# EAGLE design rumblecation+ble (EAGLE 6.6.0)

## Sheet 1 of 4
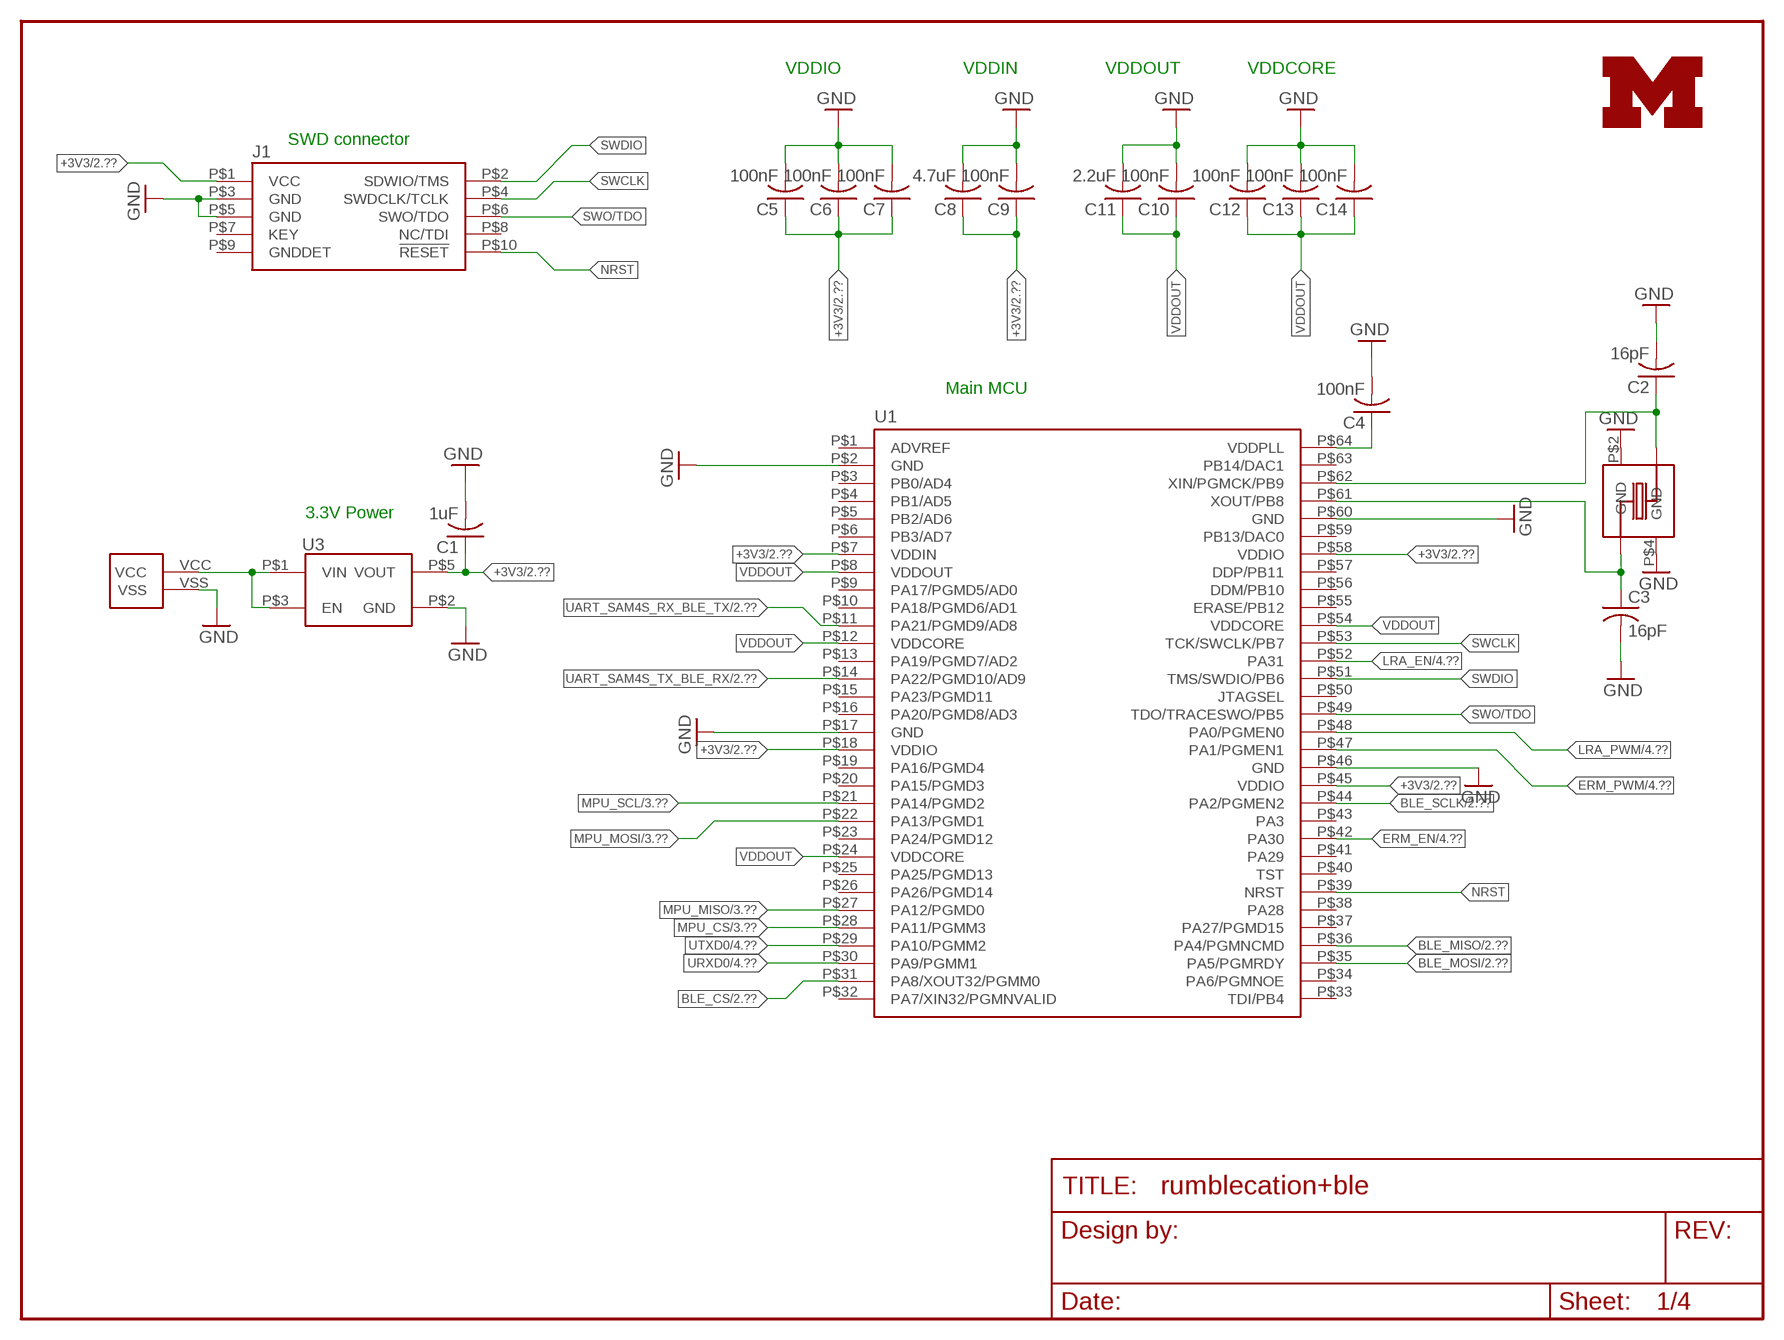
[diagram p0: schematic, sheet 1]

### Parts
C1  1uF  C-USC0402  [C0402]
C2  16pF  C-USC0402  [C0402]
C3  16pF  C-USC0402  [C0402]
C4  100nF  C-USC0402  [C0402]
C5  100nF  C-USC0402  [C0402]
C6  100nF  C-USC0402  [C0402]
C7  100nF  C-USC0402  [C0402]
C8  4.7uF  C-USC0603  [C0603]
C9  100nF  C-USC0402  [C0402]
C10  100nF  C-USC0402  [C0402]
C11  2.2uF  C-USC0603  [C0603]
C12  100nF  C-USC0402  [C0402]
C13  100nF  C-USC0402  [C0402]
C14  100nF  C-USC0402  [C0402]
J1  FCI_CORTEX_SWD_CONNECTOR  [FCI_10_PIN_SMD_0.5]
J2  JST_S2B-PH-SM4-TB_CONNECTOR  [JST_S2B-PH-SM4-TB_CONNECTOR]
LOGO1  UMICH_SOLID_TINY  [UMICH_SOLID_50MIL]
U1  ATSAMD4S2BA-AU  [ATMEL_10X10_QFP_64]
U3  TLV73333PDBVT  [TI_SOT-23-5]
Y1  ECS_ECS-120-20-33-CKM-TR  [ECS_ECX-32]

### Nets
+3V3: C1.1 C5.1 C6.1 C7.1 C8.1 C9.1 J1.P$1(VCC) U1.P$7(VDDIN) U1.P$18(VDDIO) U1.P$45(VDDIO) U1.P$58(VDDIO) U3.P$5(VOUT) ; also sheet 2,3,4
BLE_CS: U1.P$31(PA8/XOUT32/PGMM0) ; also sheet 2
BLE_MISO: U1.P$36(PA4/PGMNCMD) ; also sheet 2
BLE_MOSI: U1.P$35(PA5/PGMRDY) ; also sheet 2
BLE_SCLK: U1.P$44(PA2/PGMEN2) ; also sheet 2
ERM_EN: U1.P$42(PA30) ; also sheet 4
ERM_PWM: U1.P$47(PA1/PGMEN1) ; also sheet 4
GND: C1.2 C2.2 C3.2 C4.2 C5.2 C6.2 C7.2 C8.2 C9.2 C10.2 C11.2 C12.2 C13.2 C14.2 J1.P$3(GND) J1.P$5(GND) J2.VSS U1.P$2(GND) U1.P$17(GND) U1.P$46(GND) U1.P$60(GND) U3.P$2(GND) Y1.P$2(GND) Y1.P$4(GND) ; also sheet 2,3,4
LRA_EN: U1.P$52(PA31) ; also sheet 4
LRA_PWM: U1.P$48(PA0/PGMEN0) ; also sheet 4
MPU_CS: U1.P$28(PA11/PGMM3) ; also sheet 3
MPU_MISO: U1.P$27(PA12/PGMD0) ; also sheet 3
MPU_MOSI: U1.P$22(PA13/PGMD1) ; also sheet 3
MPU_SCL: U1.P$21(PA14/PGMD2) ; also sheet 3
N$6: C4.1 U1.P$64(VDDPLL)
N$7: J2.VCC U3.P$1(VIN) U3.P$3(EN)
NRST: J1.P$10(!RESET!) U1.P$39(NRST)
SWCLK: J1.P$4(SWDCLK/TCLK) U1.P$53(TCK/SWCLK/PB7)
SWDIO: J1.P$2(SDWIO/TMS) U1.P$51(TMS/SWDIO/PB6)
SWO/TDO: J1.P$6(SWO/TDO) U1.P$49(TDO/TRACESWO/PB5)
UART_SAM4S_RX_BLE_TX: U1.P$11(PA21/PGMD9/AD8) ; also sheet 2
UART_SAM4S_TX_BLE_RX: U1.P$14(PA22/PGMD10/AD9) ; also sheet 2
URXD0: U1.P$30(PA9/PGMM1) ; also sheet 4
UTXD0: U1.P$29(PA10/PGMM2) ; also sheet 4
VDDOUT: C10.1 C11.1 C12.1 C13.1 C14.1 U1.P$8(VDDOUT) U1.P$12(VDDCORE) U1.P$24(VDDCORE) U1.P$54(VDDCORE)
XIN: C2.1 U1.P$62(XIN/PGMCK/PB9) Y1.P$1
XOUT: C3.1 U1.P$61(XOUT/PB8) Y1.P$3
Unconnected: J1.P$7(KEY) J1.P$8(NC/TDI) J1.P$9(GNDDET) U1.P$1(ADVREF) U1.P$3(PB0/AD4) U1.P$4(PB1/AD5) U1.P$5(PB2/AD6) U1.P$6(PB3/AD7) U1.P$9(PA17/PGMD5/AD0) U1.P$10(PA18/PGMD6/AD1) U1.P$13(PA19/PGMD7/AD2) U1.P$15(PA23/PGMD11) U1.P$16(PA20/PGMD8/AD3) U1.P$19(PA16/PGMD4) U1.P$20(PA15/PGMD3) U1.P$23(PA24/PGMD12) U1.P$25(PA25/PGMD13) U1.P$26(PA26/PGMD14) U1.P$32(PA7/XIN32/PGMNVALID) U1.P$33(TDI/PB4) U1.P$34(PA6/PGMNOE) U1.P$37(PA27/PGMD15) U1.P$38(PA28) U1.P$40(TST) U1.P$41(PA29) U1.P$43(PA3) U1.P$50(JTAGSEL) U1.P$55(ERASE/PB12) U1.P$56(DDM/PB10) U1.P$57(DDP/PB11) U1.P$59(PB13/DAC0) U1.P$63(PB14/DAC1)

### Notes on the sheet
- VDDIO | VDDIN | VDDOUT | VDDCORE
- SWD connector
- Main MCU
- 3.3V Power

## Sheet 2 of 4
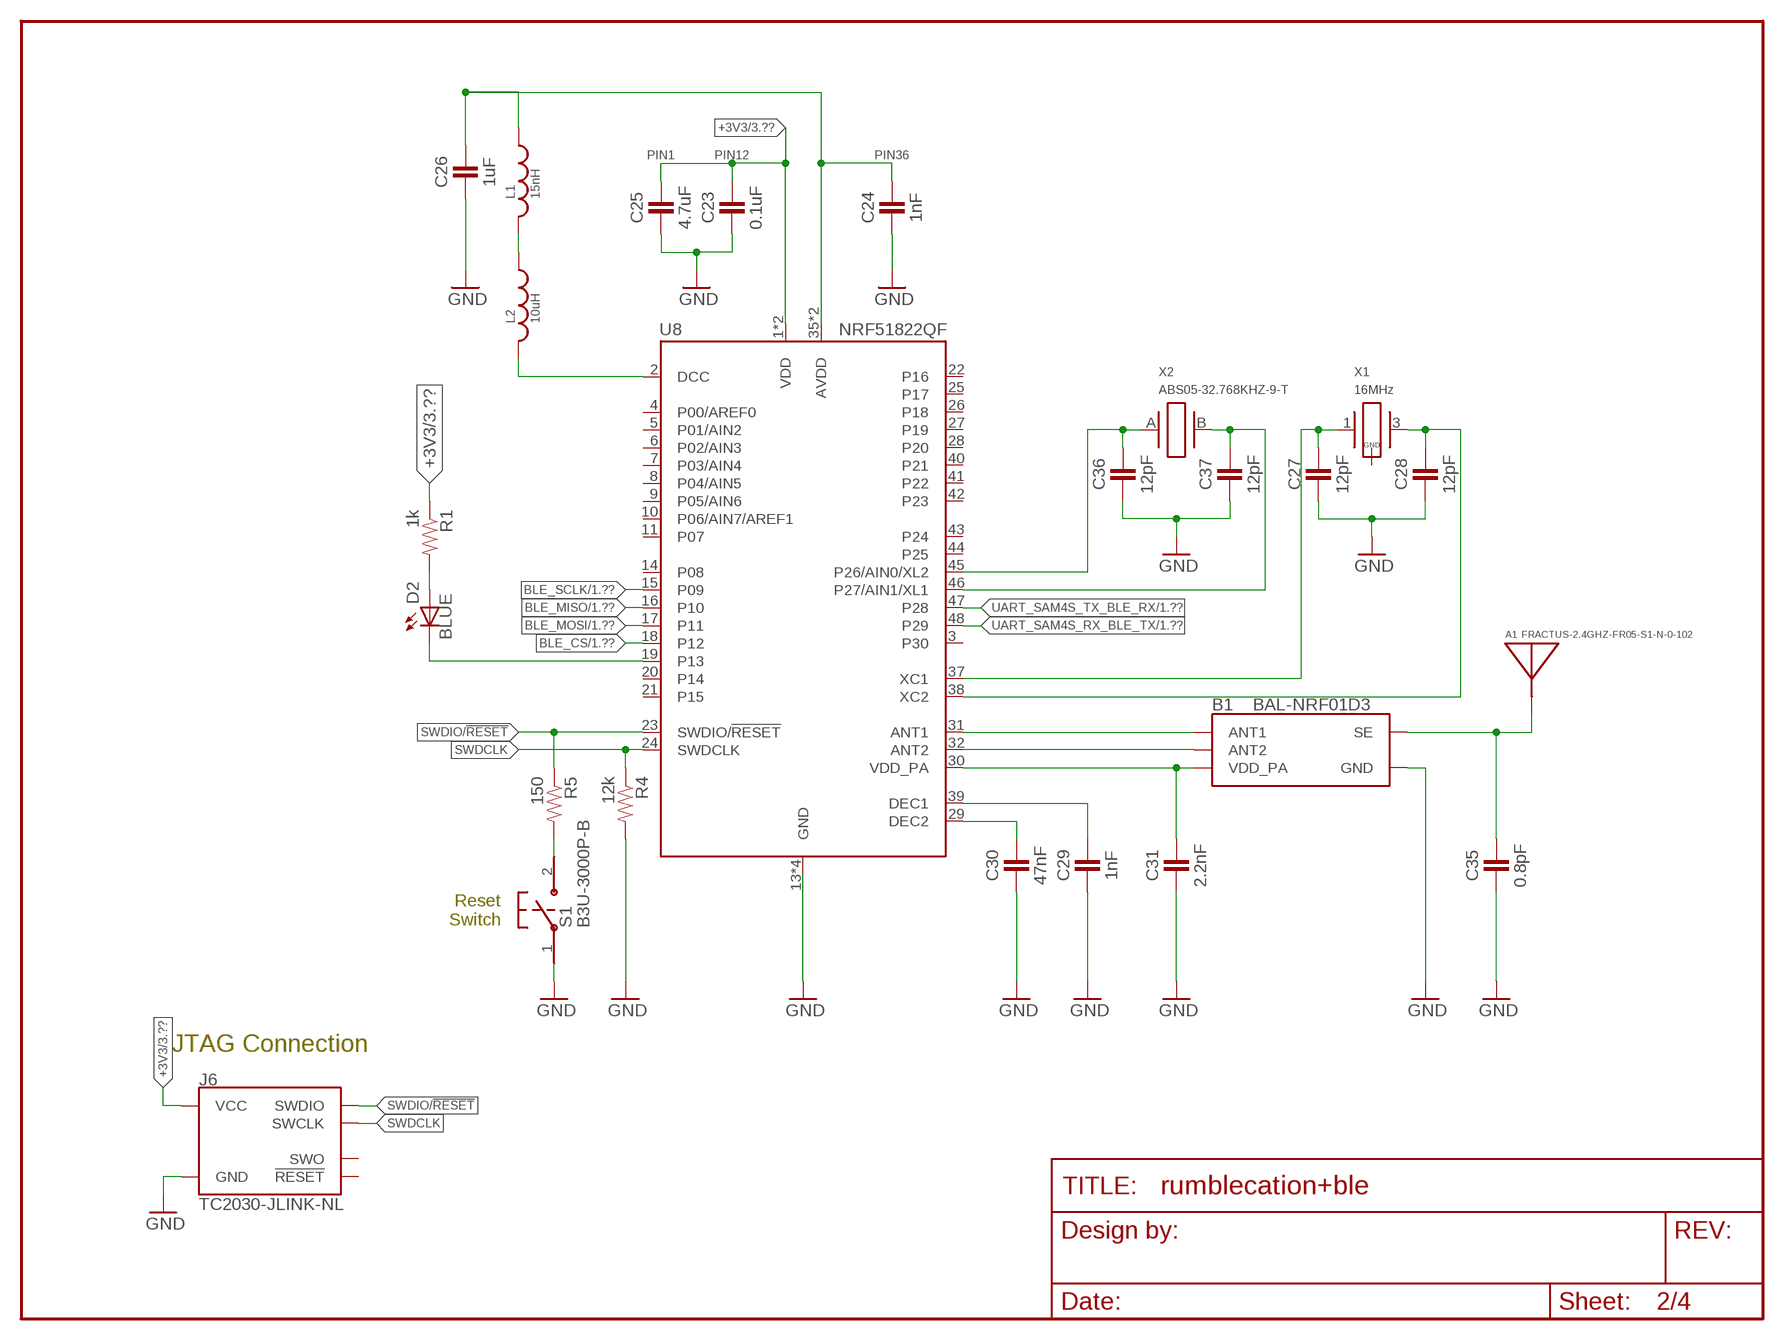
[diagram p1: schematic, sheet 2]

### Parts
A1  FRACTUS-2.4GHZ-FR05-S1-N-0-102  [FRACTUS-ANTENNA-FR05-S1-N-0-102]
B1  BAL-NRF01D3  [BAL-NRF01D3]
C23  0.1uF  CAPACITOR  [0402_CAP]
C24  1nF  CAPACITOR  [0402_CAP]
C25  4.7uF  CAPACITOR  [0402_CAP]
C26  1uF  CAPACITOR  [0402_CAP]
C27  12pF  CAPACITOR  [0402_CAP]
C28  12pF  CAPACITOR  [0402_CAP]
C29  1nF  CAPACITOR  [0402_CAP]
C30  47nF  CAPACITOR  [0402_CAP]
C31  2.2nF  CAPACITOR  [0402_CAP]
C35  0.8pF  CAPACITOR  [0402_CAP]
C36  12pF  CAPACITOR  [0402_CAP]
C37  12pF  CAPACITOR  [0402_CAP]
D2  BLUE  LED0603  [LED-0603]
J6  TC2030-JLINK-NL  [TC2030-IDC-NL]
L1  15nH  INDUCTOR0402  [0402_CAP]
L2  10uH  INDUCTOR0603  [0603_CAP]
R1  1k  RESISTOR  [0402_RES]
R4  12k  RESISTOR  [0402_RES]
R5  150  RESISTOR  [0402_RES]
S1  B3U-3000P-B  [B3U-3000P-B]
U8  NRF51822QF  [QFN-48-6MM]
X1  16MHz  TXC-8Y  [TXC-8Y]
X2  ABS05-32.768KHZ-9-T  [ABS05]

### Nets
+3V3: C23.1 C25.1 J6.1(VCC) R1.1 U8.1(VDD) U8.12(VDD) ; also sheet 1,3,4
A0: C36.1 U8.45(P26/AIN0/XL2) X2.A
A1: C37.1 U8.46(P27/AIN1/XL1) X2.B
AVDD: C24.1 C26.1 L1.1 U8.35(AVDD) U8.36(AVDD)
BLE_CS: U8.18(P12) ; also sheet 1
BLE_MISO: U8.16(P10) ; also sheet 1
BLE_MOSI: U8.17(P11) ; also sheet 1
BLE_SCLK: U8.15(P09) ; also sheet 1
DCC: L2.2 U8.2(DCC)
GND: B1.GND C23.2 C24.2 C25.2 C26.2 C27.2 C28.2 C29.2 C30.2 C31.2 C35.2 C36.2 C37.2 J6.5(GND) R4.2 S1.1 U8.13(GND) U8.33(GND) U8.34(GND) U8.GND ; also sheet 1,3,4
N$11: B1.ANT1 U8.31(ANT1)
N$12: B1.ANT2 U8.32(ANT2)
N$13: A1.1(ANTENNA) B1.SE C35.1
N$14: L1.2 L2.1
N$15: D2.C U8.19(P13)
N$16: C27.1 U8.37(XC1) X1.1
N$17: C28.1 U8.38(XC2) X1.3
N$18: C29.1 U8.39(DEC1)
N$19: C30.1 U8.29(DEC2)
N$20: R5.2 S1.2
N$23: D2.A R1.2
SWDCLK: J6.4(SWCLK) R4.1 U8.24(SWDCLK)
SWDIO/!RESET: J6.2(SWDIO) R5.1 U8.23(SWDIO/!RESET)
UART_SAM4S_RX_BLE_TX: U8.48(P29) ; also sheet 1
UART_SAM4S_TX_BLE_RX: U8.47(P28) ; also sheet 1
VDD_PA: B1.VCC(VDD_PA) C31.1 U8.30(VDD_PA)
Unconnected: J6.3(!RESET) J6.6(SWO) U8.3(P30) U8.4(P00/AREF0) U8.5(P01/AIN2) U8.6(P02/AIN3) U8.7(P03/AIN4) U8.8(P04/AIN5) U8.9(P05/AIN6) U8.10(P06/AIN7/AREF1) U8.11(P07) U8.14(P08) U8.20(P14) U8.21(P15) U8.22(P16) U8.25(P17) U8.26(P18) U8.27(P19) U8.28(P20) U8.40(P21) U8.41(P22) U8.42(P23) U8.43(P24) U8.44(P25) X1.2(GND) X1.4(GND)

### Notes on the sheet
- PIN1 | PIN12 | PIN36
- Reset
  Switch
- JTAG Connection

## Sheet 3 of 4
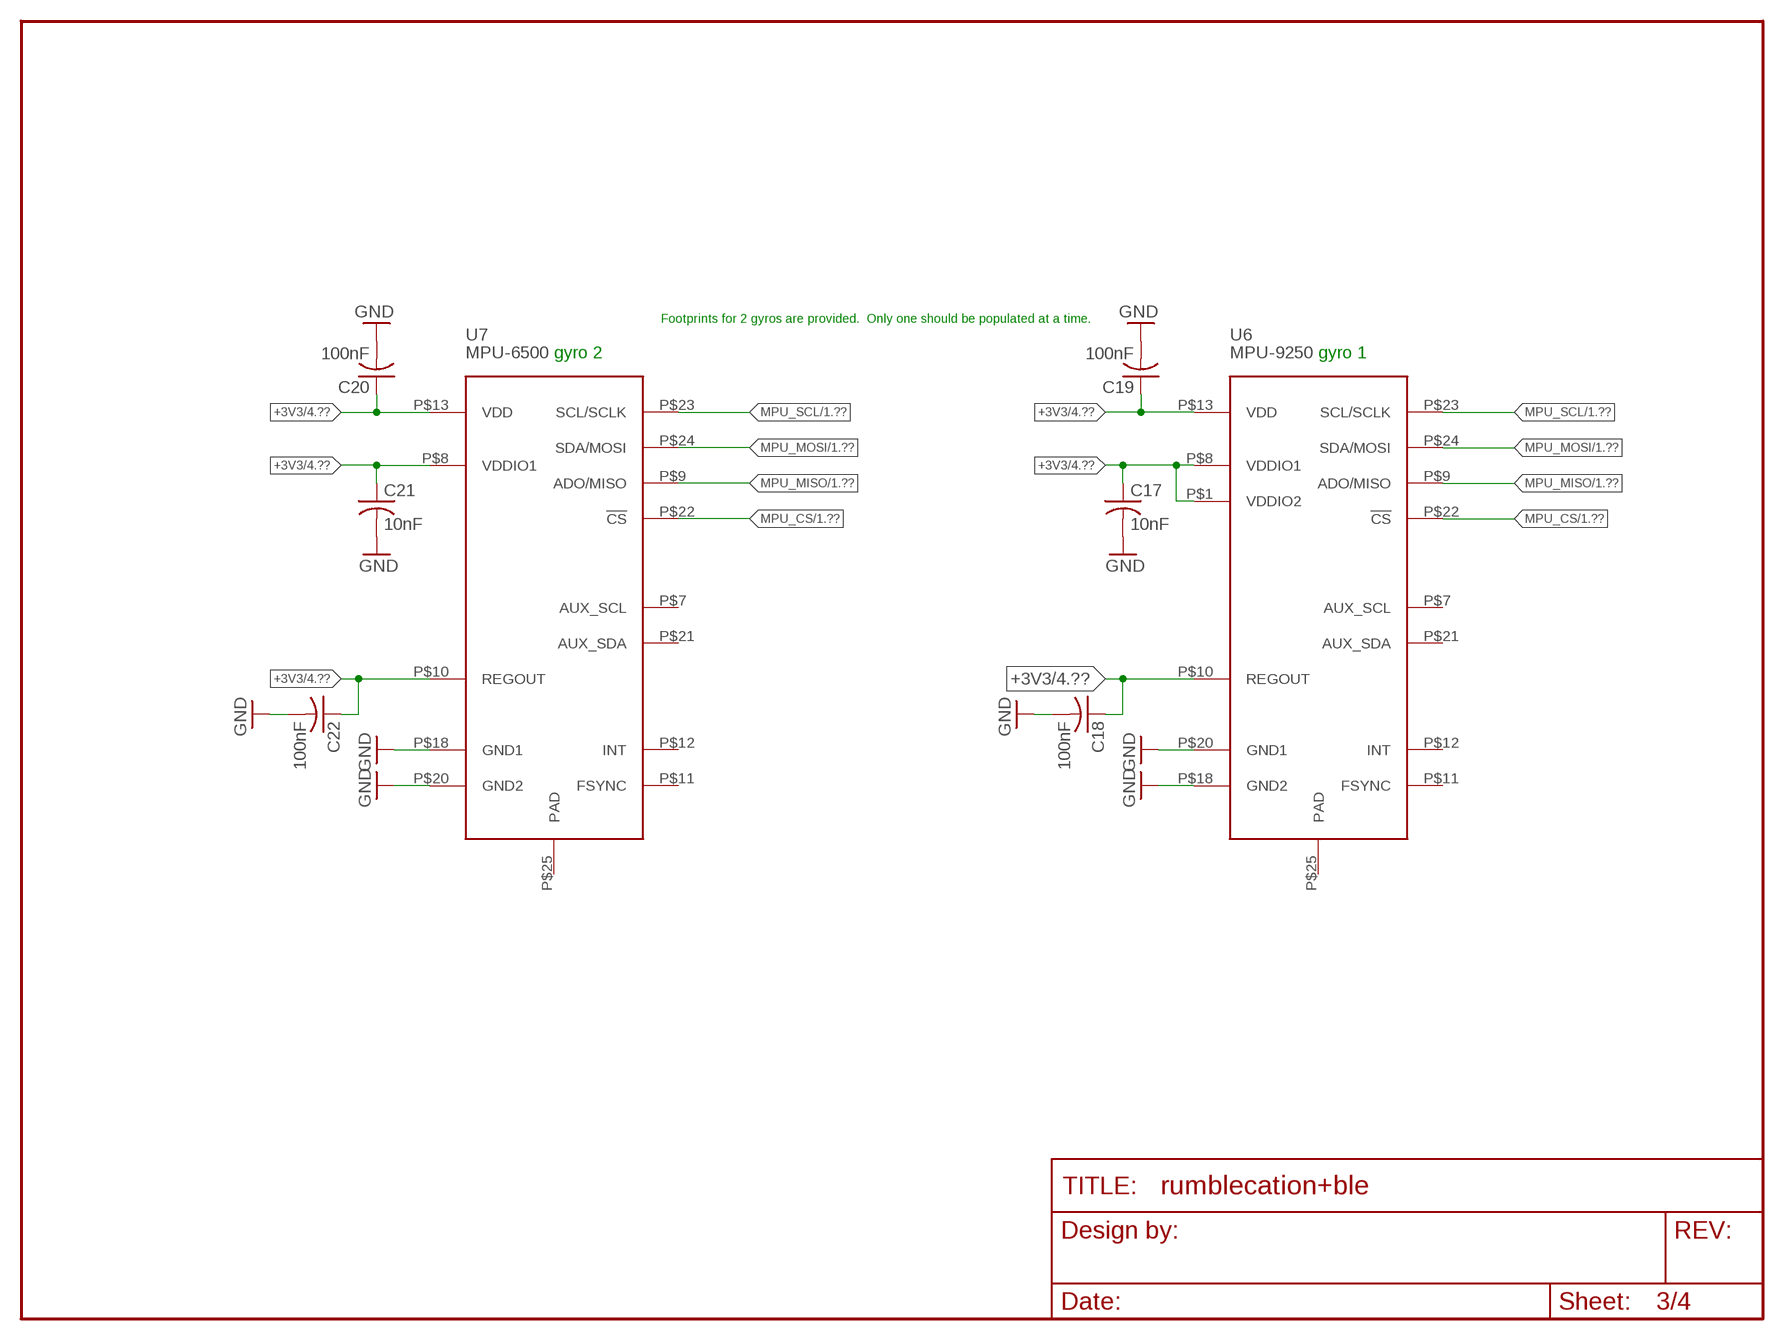
[diagram p2: schematic, sheet 3]

### Parts
C17  10nF  C-USC0402  [C0402]
C18  100nF  C-USC0402  [C0402]
C19  100nF  C-USC0402  [C0402]
C20  100nF  C-USC0402  [C0402]
C21  10nF  C-USC0402  [C0402]
C22  100nF  C-USC0402  [C0402]
U6  MPU-9250  [MPU-9X50]
U7  MPU-6500  [MPU-9X50]

### Nets
+3V3: C17.1 C19.1 C20.1 C21.1 C22.1 U6.P$1(VDDIO2) U6.P$8(VDDIO1) U6.P$13(VDD) U7.P$8(VDDIO1) U7.P$10(REGOUT) U7.P$13(VDD) ; also sheet 1,2,4
GND: C17.2 C18.2 C19.2 C20.2 C21.2 C22.2 U6.P$18(GND2) U6.P$20(GND1) U7.P$18(GND1) U7.P$20(GND2) ; also sheet 1,2,4
MPU_CS: U6.P$22(!CS) U7.P$22(!CS) ; also sheet 1
MPU_MISO: U6.P$9(ADO/MISO) U7.P$9(ADO/MISO) ; also sheet 1
MPU_MOSI: U6.P$24(SDA/MOSI) U7.P$24(SDA/MOSI) ; also sheet 1
MPU_SCL: U6.P$23(SCL/SCLK) U7.P$23(SCL/SCLK) ; also sheet 1
N$9: C18.1 U6.P$10(REGOUT)
Unconnected: U6.P$7(AUX_SCL) U6.P$11(FSYNC) U6.P$12(INT) U6.P$21(AUX_SDA) U6.P$25(PAD) U7.P$7(AUX_SCL) U7.P$11(FSYNC) U7.P$12(INT) U7.P$21(AUX_SDA) U7.P$25(PAD)

### Notes on the sheet
- Footprints for 2 gyros are provided.  Only one should be populated at a time.
- gyro 2 | gyro 1

## Sheet 4 of 4
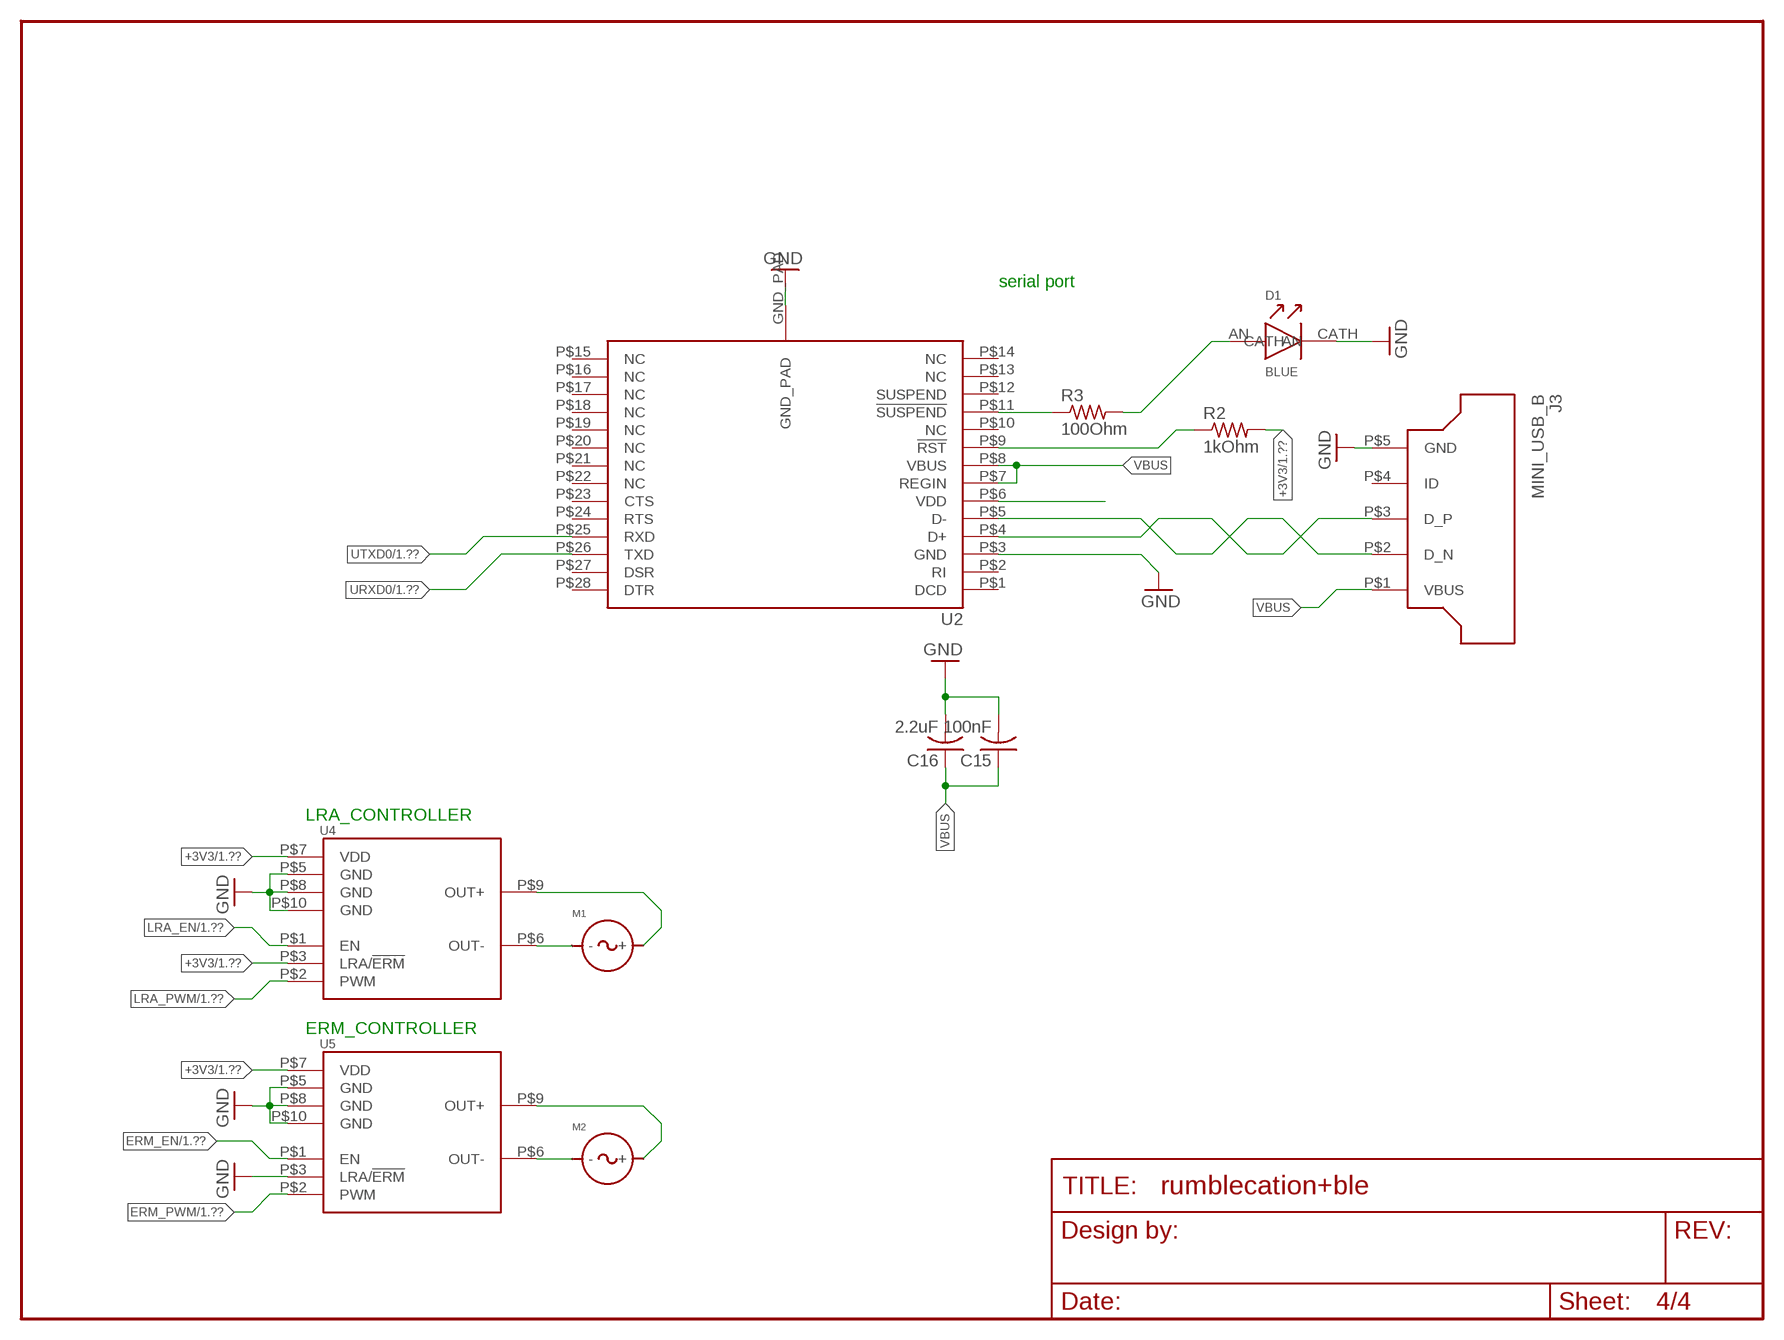
[diagram p3: schematic, sheet 4]

### Parts
C15  100nF  C-USC0402  [C0402]
C16  2.2uF  C-USC0402  [C0402]
D1  BLUE  LED0603  [D0603]
J3  MINI_USB_B  [UX60SC-MB-5ST]
M1  PRECISION_MICRODRIVES_C100-10  [PRECISION_MICRODRIVES_10MM]
M2  PRECISION_MICRODRIVES_310-113  [PRECISION_MICRODRIVES_10MM]
R2  1kOhm  R-US_R0402  [R0402]
R3  100Ohm  R-US_R0402  [R0402]
U2  SILABS_CP2102  [SILABS_QFN28]
U4  TI_DRV2603  [TI_S-PWQFN-N10]
U5  TI_DRV2603  [TI_S-PWQFN-N10]

### Nets
+3V3: R2.2 U2.P$6(VDD) U4.P$3(LRA/!ERM!) U4.P$7(VDD) U5.P$7(VDD) ; also sheet 1,2,3
D+: J3.P$3(D_P) U2.P$4(D+)
D-: J3.P$2(D_N) U2.P$5(D-)
ERM_EN: U5.P$1(EN) ; also sheet 1
ERM_PWM: U5.P$2(PWM) ; also sheet 1
GND: C15.2 C16.2 D1.CATH J3.P$5(GND) U2.GND_PAD U2.P$3(GND) U4.P$5(GND) U4.P$8(GND) U4.P$10(GND) U5.P$3(LRA/!ERM!) U5.P$5(GND) U5.P$8(GND) U5.P$10(GND) ; also sheet 1,2,3
LRA_EN: U4.P$1(EN) ; also sheet 1
LRA_PWM: U4.P$2(PWM) ; also sheet 1
N$1: R2.1 U2.P$9(!RST!)
N$2: M1.P$1(-) U4.P$6(OUT-)
N$3: M1.P$2(+) U4.P$9(OUT+)
N$4: R3.1 U2.P$11(!SUSPEND!)
N$5: D1.AN R3.2
N$8: M2.P$2(+) U5.P$9(OUT+)
N$10: M2.P$1(-) U5.P$6(OUT-)
URXD0: U2.P$26(TXD) ; also sheet 1
UTXD0: U2.P$25(RXD) ; also sheet 1
VBUS: C15.1 C16.1 J3.P$1(VBUS) U2.P$7(REGIN) U2.P$8(VBUS)
Unconnected: J3.P$4(ID) U2.P$1(DCD) U2.P$2(RI) U2.P$10(NC) U2.P$12(SUSPEND) U2.P$13(NC) U2.P$14(NC) U2.P$15(NC) U2.P$16(NC) U2.P$17(NC) U2.P$18(NC) U2.P$19(NC) U2.P$20(NC) U2.P$21(NC) U2.P$22(NC) U2.P$23(CTS) U2.P$24(RTS) U2.P$27(DSR) U2.P$28(DTR)

### Notes on the sheet
- serial port
- LRA_CONTROLLER
- ERM_CONTROLLER

## Library data of the parts
A1 = chips:FRACTUS-2.4GHZ-FR05-S1-N-0-102: Fractus Compact Reach XtendTM chip antenna is engineered specifically for Bluetooth, WLAN 802.11 b/g/n and other wireless devices operating at the ISM 2.4 GHz band. Compact Reach Xtend combines small form factor size and high performance to improve the functionality of your wireless devices.; RICHARDSON_RFPD: FR05-S1-N-0102B
B1 = chips:BAL-NRF01D3: 50 ohm nominal input / conjugate match balun to nRF51422-QFAA, nRF24LE1, nRF51822-QFAA/AB, with integrated harmonic filter; DIGIKEY: 497-13637-1-ND; MOUSER: 511-BAL-NRF01D3
C1-C7 C9 C10 C12-C22 = rumbleaction_parts_lib:C-US: CAPACITOR, American symbol
C8 C11 = adafruit:C-US: CAPACITOR, American symbol
C23 = passives:CAPACITOR: 0402 Capacitor; DIGIKEY: 445-4952-1-ND
C24 C29 = passives:CAPACITOR: 0402 Capacitor; DIGIKEY: 490-1303-1-ND
C25 = passives:CAPACITOR: 0402 Capacitor; DIGIKEY: 445-5947-1-ND
C26 = passives:CAPACITOR: 0402 Capacitor; DIGIKEY: 1276-1513-1-ND
C27 C28 C36 C37 = passives:CAPACITOR: 0402 Capacitor; DIGIKEY: 490-6197-1-ND
C30 = passives:CAPACITOR: 0402 Capacitor; DIGIKEY: 445-1264-1-ND
C31 = passives:CAPACITOR: 0402 Capacitor; DIGIKEY: 490-5419-1-ND
C35 = passives:CAPACITOR: 0402 Capacitor; DIGIKEY: 490-6269-1-ND
D1 = john_mamish_assorted_analog_library:LED0603
D2 = SparkFun-LED:LED: LEDs Standard schematic elements and footprints for 5mm, 3mm, 1206, and 0603 sized LEDs. 5mm - Spark Fun Electronics SKU : COM-00529 (and others)
J1 = rumbleaction_parts_lib:FCI_CORTEX_SWD_CONNECTOR
J2 = rumbleaction_parts_lib:JST_S2B-PH-SM4-TB_CONNECTOR
J3 = john_mamish_connector_library:MINI_USB_B: Mini USB-B Surface Mount; DIGIKEY_PN: H11671CT-ND
J6 = connector:TC2030-JLINK
L1 = passives:INDUCTOR; DIGIKEY: 587-1521-1-ND
L2 = passives:INDUCTOR; DIGIKEY: 490-4025-1-ND
LOGO1 = logos:UMICH_SOLID
M1 = rumbleaction_parts_lib:PRECISION_MICRODRIVES_C100-10
M2 = rumbleaction_parts_lib:PRECISION_MICRODRIVES_310-113
R1 = passives:RESISTOR: Resistor Basic schematic elements and footprints for 0603, 1206, and PTH resistors.; DIGIKEY: RHM1.0KCECT-ND
R2 R3 = adafruit:R-US_: RESISTOR, American symbol
R4 = passives:RESISTOR: Resistor Basic schematic elements and footprints for 0603, 1206, and PTH resistors.; DIGIKEY: RHM12.0KCDCT-ND
R5 = passives:RESISTOR: Resistor Basic schematic elements and footprints for 0603, 1206, and PTH resistors.; DIGIKEY: RHM150CDCT-ND
S1 = switches:B3U; DIGIKEY: SW1256CT-ND
U1 = rumbleaction_parts_lib:ATSAMD4S2BA-AU
U2 = rumbleaction_parts_lib:SILABS_CP2102
U3 = rumbleaction_parts_lib:TLV73333PDBVT
U4 U5 = rumbleaction_parts_lib:TI_DRV2603
U6 = rumbleaction_parts_lib:MPU-9250: 9-Axis Gyro+Accel+Magnetometer
U7 = rumbleaction_parts_lib:MPU-6500
U8 = chips:NRF51822: Multiprotocol Bluetooth® 4.0 low energy/2.4 GHz RF SoC; DIGIKEY: 1490-1032-1-ND; MOUSER: 949-NRF51822-QFAB-R7
X1 = crystals:TXC-8Y: 2mmx1.6mm SMD Crystal; DIGIKEY: 887-2003-1-ND
X2 = crystals:ABS05-32.768KHZ: 32.768kHz Crystal; DIGIKEY: 535-11897-1-ND
Y1 = rumbleaction_parts_lib:ECS_ECS-120-20-33-CKM-TR

## Board
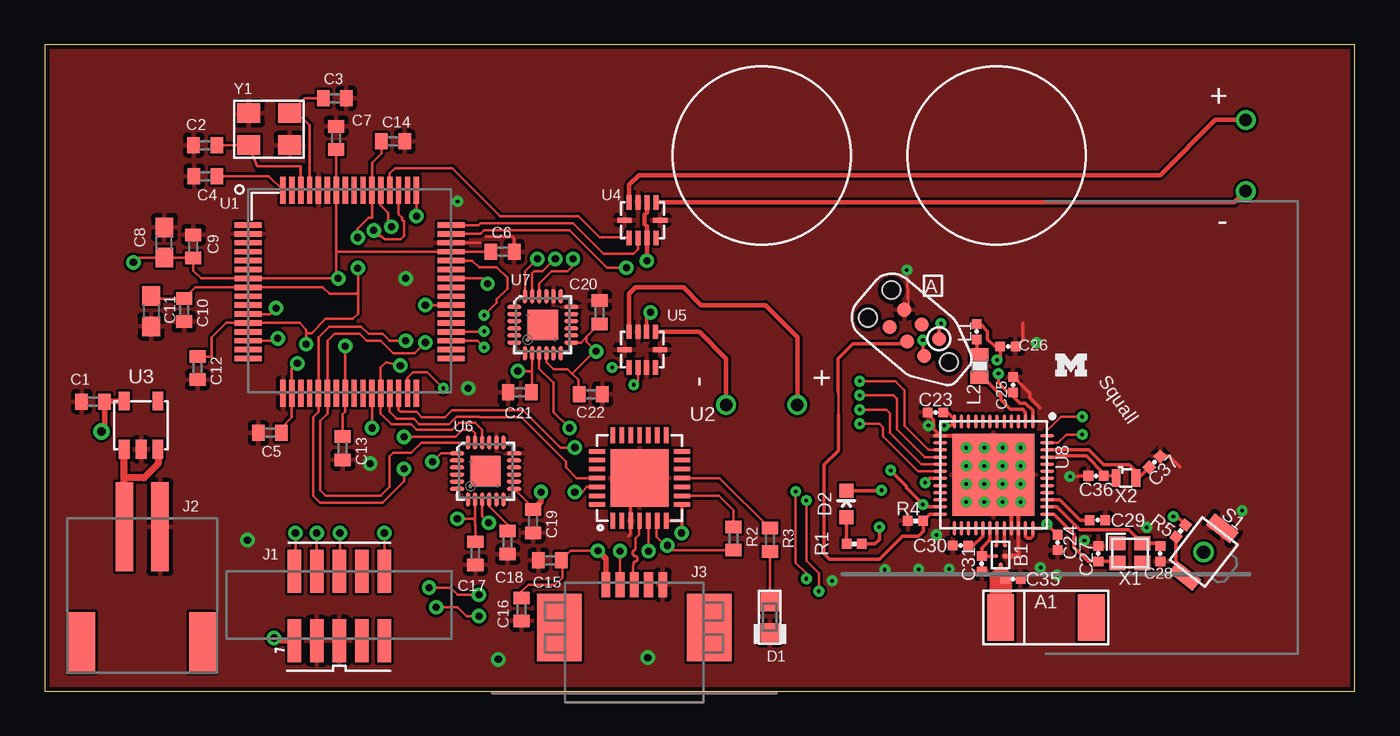
[diagram p4: board, top side]
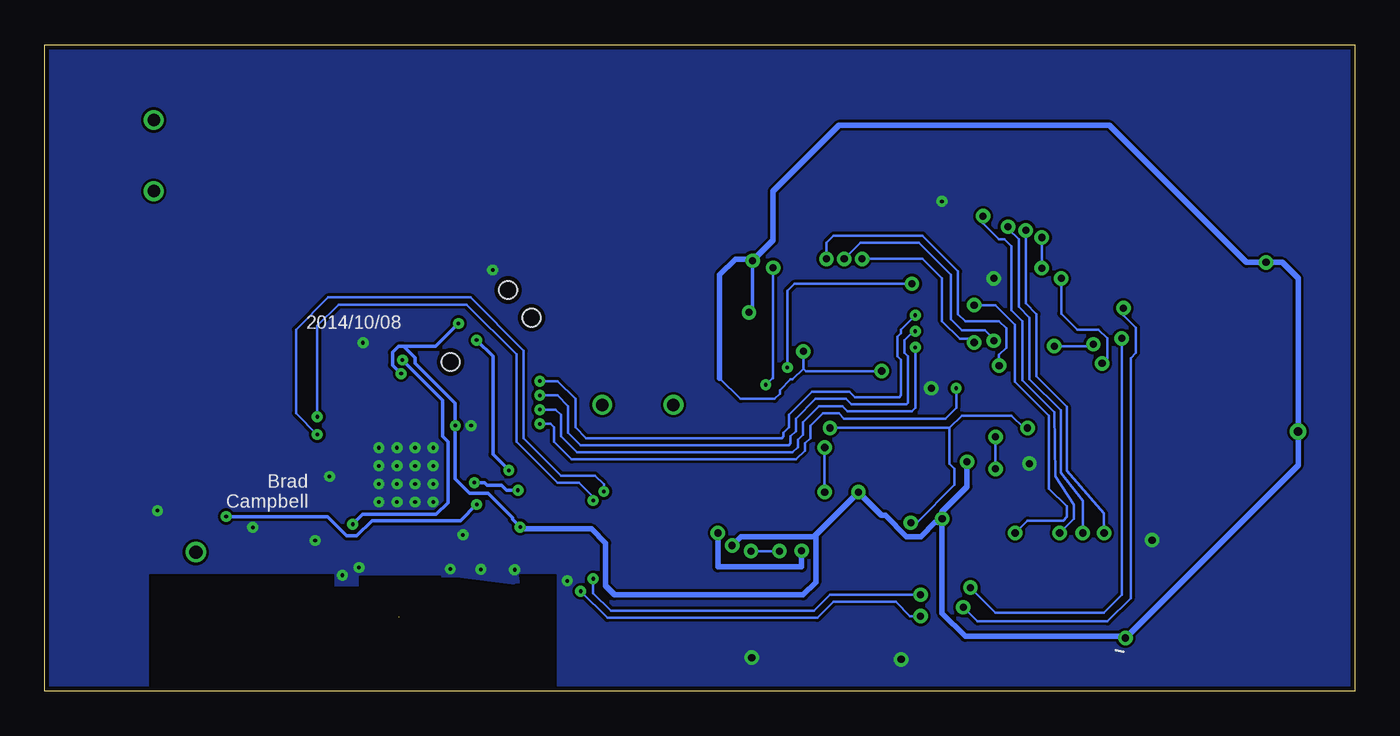
[diagram p5: board, bottom side, seen from below]

Size 73.64 x 36.34 mm. Coordinates in mm from the lower left corner, seen from the top.
Outline: 0,0 73.64,0 73.64,36.34 0,36.34 0,0
Copper layers (1*16): Top 0.0178mm / dielectric 59mil / Bottom 0.0178mm
Design rules "sunstone-2lyr_v1.0.0.3": minimum track width 6mil, minimum drill 14mil, track to track 6mil, track to pad 6mil, pad to pad 6mil, via to via 6mil, smd to smd 6mil, copper to edge 10mil, drill to drill 16mil, minimum pad ring 8mil, minimum via ring 8mil, stop-mask expansion 3mil, vias tented up to drill 50mil, thermal gap 10mil

### Footprints (pad centres in the part's own frame; a part is rotated, then mirrored left to right if it is on the bottom)
FRACTUS-ANTENNA-FR05-S1-N-0-102 = smd 1.5 x 2.6: 1 -2.55,0; 2 2.55,0
BAL-NRF01D3 = smd 0.22 x 0.22: ANT1 -0.537,-0.25; ANT2 -0.537,0.25; GND 0.069,0.25; SE 0.537,0; VCC 0.069,-0.25
C0402 = smd 0.7 x 0.9: 1 -0.65,0; 2 0.65,0
C0603 = smd 1.1 x 1: 1 -0.85,0; 2 0.85,0
0402_CAP = smd 0.536 x 0.546: 1 -0.433,0; 2 0.433,0
D0603 = smd 1 x 1.09: AN 0,-0.89; CATH 0,0.89
LED-0603 = smd 0.8 x 0.8: A 0,-0.75; C 0,0.75
FCI_10_PIN_SMD_0.5 = smd 0.76 x 2.4: P$1 0,-3.9; P$2 0,0; P$3 1.27,-3.9; P$4 1.27,0; P$5 2.54,-3.9; P$6 2.54,0; P$7 3.81,-3.9; P$8 3.81,0; P$9 5.08,-3.9; P$10 5.08,0
JST_S2B-PH-SM4-TB_CONNECTOR = smd 1.5 x 3.4: P$1 0,0; P$3 6.8,0 | smd 1 x 5: VCC 4.4,-6.5; VSS 2.4,-6.5
UX60SC-MB-5ST = smd 2.5 x 3.8: M$1 -4.2,3.7; M$2 4.2,3.7 | smd 0.5 x 1.4: P$1 -1.6,6.1; P$2 -0.8,6.1; P$3 0,6.1; P$4 0.8,6.1; P$5 1.6,6.1
TC2030-IDC-NL = smd 0.787 x 0.787: 1 -1.27,-0.635; 2 -1.27,0.635; 3 0,-0.635; 4 0,0.635; 5 1.27,-0.635; 6 1.27,0.635 | hole 1.016: -2.54,0; 2.54,1.016; 2.54,-1.016
0603_CAP = smd 0.7 x 1: 1 -0.65,0; 2 0.65,0
PRECISION_MICRODRIVES_10MM = drill 0.7: P$1 -14,2; P$2 -14,-2
0402_RES = smd 0.536 x 0.546: 1 -0.433,0; 2 0.433,0
R0402 = smd 0.7 x 0.9: 1 -0.65,0; 2 0.65,0
B3U-3000P-B = smd 0.8 x 1.7: 1 -1.7,0; 2 1.7,0 | drill 0.75: P$1 0,0
ATMEL_10X10_QFP_64 = smd 1.5 x 0.3: P$1 0,0; P$2 0,-0.5; P$3 0,-1; P$4 0,-1.5; P$5 0,-2; P$6 0,-2.5; P$7 0,-3; P$8 0,-3.5; P$9 0,-4; P$10 0,-4.5; P$11 0,-5; P$12 0,-5.5; P$13 0,-6; P$14 0,-6.5; P$15 0,-7; P$16 0,-7.5; P$33 11.4,-7.5; P$34 11.4,-7; P$35 11.4,-6.5; P$36 11.4,-6; P$37 11.4,-5.5; P$38 11.4,-5; P$39 11.4,-4.5; P$40 11.4,-4; P$41 11.4,-3.5; P$42 11.4,-3; P$43 11.4,-2.5; P$44 11.4,-2; P$45 11.4,-1.5; P$46 11.4,-1; P$47 11.4,-0.5; P$48 11.4,0 | smd 0.3 x 1.5: P$17 1.95,-9.45; P$18 2.45,-9.45; P$19 2.95,-9.45; P$20 3.45,-9.45; P$21 3.95,-9.45; P$22 4.45,-9.45; P$23 4.95,-9.45; P$24 5.45,-9.45; P$25 5.95,-9.45; P$26 6.45,-9.45; P$27 6.95,-9.45; P$28 7.45,-9.45; P$29 7.95,-9.45; P$30 8.45,-9.45; P$31 8.95,-9.45; P$32 9.45,-9.45; P$49 9.45,1.95; P$50 8.95,1.95; P$51 8.45,1.95; P$52 7.95,1.95; P$53 7.45,1.95; P$54 6.95,1.95; P$55 6.45,1.95; P$56 5.95,1.95; P$57 5.45,1.95; P$58 4.95,1.95; P$59 4.45,1.95; P$60 3.95,1.95; P$61 3.45,1.95; P$62 2.95,1.95; P$63 2.45,1.95; P$64 1.95,1.95
SILABS_QFN28 = smd 3.25 x 3.25: GND_PAD 2.4,-1.5 | smd 0.9 x 0.25: P$1 0,0; P$2 0,-0.5; P$3 0,-1; P$4 0,-1.5; P$5 0,-2; P$6 0,-2.5; P$7 0,-3; P$15 4.8,-3; P$16 4.8,-2.5; P$17 4.8,-2; P$18 4.8,-1.5; P$19 4.8,-1; P$20 4.8,-0.5; P$21 4.8,0 | smd 0.25 x 0.9: P$8 0.9,-3.9; P$9 1.4,-3.9; P$10 1.9,-3.9; P$11 2.4,-3.9; P$12 2.9,-3.9; P$13 3.4,-3.9; P$14 3.9,-3.9; P$22 3.9,0.9; P$23 3.4,0.9; P$24 2.9,0.9; P$25 2.4,0.9; P$26 1.9,0.9; P$27 1.4,0.9; P$28 0.9,0.9
TI_SOT-23-5 = smd 0.6 x 1.05: P$1 0,-2.7; P$2 0.95,-2.7; P$3 1.9,-2.7; P$4 1.9,0; P$5 0,0
TI_S-PWQFN-N10 = smd 0.28 x 0.8: P$1 0.65,-1; P$2 1.15,-1; P$3 1.65,-1; P$4 2.15,-1; P$6 2.15,1; P$7 1.65,1; P$8 1.15,1; P$9 0.65,1 | smd 0.8 x 0.28: P$5 2.4,0; P$10 0.4,0
MPU-9X50 = smd 0.8 x 0.22: P$1 -1.6,1; P$2 -1.6,0.6; P$3 -1.6,0.2; P$4 -1.6,-0.2; P$5 -1.6,-0.6; P$6 -1.6,-1; P$13 1.6,-1; P$14 1.6,-0.6; P$15 1.6,-0.2; P$16 1.6,0.2; P$17 1.6,0.6; P$18 1.6,1 | smd 0.22 x 0.8: P$7 -1,-1.6; P$8 -0.6,-1.6; P$9 -0.2,-1.6; P$10 0.2,-1.6; P$11 0.6,-1.6; P$12 1,-1.6; P$19 1,1.6; P$20 0.6,1.6; P$21 0.2,1.6; P$22 -0.2,1.6; P$23 -0.6,1.6; P$24 -1,1.6 | smd 1.7 x 1.7: P$25 0,0
QFN-48-6MM = smd 0.8 x 0.203: 1 -3,2.2; 2 -3,1.8; 3 -3,1.4; 4 -3,1; 5 -3,0.6; 6 -3,0.2; 7 -3,-0.2; 8 -3,-0.6; 9 -3,-1; 10 -3,-1.4; 11 -3,-1.8; 12 -3,-2.2; 25 3,-2.2; 26 3,-1.8; 27 3,-1.4; 28 3,-1; 29 3,-0.6; 30 3,-0.2; 31 3,0.2; 32 3,0.6; 33 3,1; 34 3,1.4; 35 3,1.8; 36 3,2.2 | smd 0.203 x 0.8: 13 -2.2,-3; 14 -1.8,-3; 15 -1.4,-3; 16 -1,-3; 17 -0.6,-3; 18 -0.2,-3; 19 0.2,-3; 20 0.6,-3; 21 1,-3; 22 1.4,-3; 23 1.8,-3; 24 2.2,-3; 37 2.2,3; 38 1.8,3; 39 1.4,3; 40 1,3; 41 0.6,3; 42 0.2,3; 43 -0.2,3; 44 -0.6,3; 45 -1,3; 46 -1.4,3; 47 -1.8,3; 48 -2.2,3 | smd 4.6 x 4.6: GND 0,0
TXC-8Y = smd 0.9 x 0.8: 1 -0.7,-0.55; 2 0.7,-0.55; 3 0.7,0.55; 4 -0.7,0.55
ABS05 = smd 0.5 x 1: A -0.55,0; B 0.55,0
ECS_ECX-32 = smd 1.3 x 1.1: P$1 0,-1.8; P$2 2.3,-1.8; P$3 2.3,0; P$4 0,0

### Placement (x,y rotation side)
A1  56.27,4.16 0 top
B1  53.73,7.67 270 top
C1  2.73,16.28 180 top
C2  9.03,30.69 180 top
C3  16.31,33.33 0 top
C4  9.05,28.94 180 top
C5  12.67,14.53 180 top
C6  25.74,24.7 0 top
C7  16.4,31.09 90 top
C8  6.74,25.22 90 top
C9  8.36,25 90 top
C10  7.84,21.42 270 top
C11  5.99,21.36 270 top
C12  8.6,18.16 270 top
C13  16.76,13.66 270 top
C14  19.59,30.9 0 top
C15  28.4,7.38 180 top
C16  26.82,4.61 270 top
C17  24.21,7.76 270 top
C18  26.03,8.36 270 top
C19  27.45,9.56 270 top
C20  31.2,21.3 90 top
C21  26.7,16.8 180 top
C22  30.7,16.7 0 top
C23  50.07,15.68 180 top
C24  56.92,8.37 270 top
C25  54.43,17.22 90 top
C26  54.14,19.38 0 top
C27  59.22,7.74 90 top
C28  62.7,7.74 270 top
C29  59.17,9.62 0 top
C30  51.47,8.2 180 top
C31  52.67,7.17 270 top
C35  54.42,6.32 0 top
C36  59.09,12.11 180 top
C37  62.39,12.9 45 top
D1  40.76,4.17 180 top
D2  45.06,10.53 0 top
J1  14.03,6.75 0 top
J2  8.89,2.74 180 top
J3  33.14,-0.1 0 top
J6  48.88,20.14 140 top
L1  52.38,20.21 270 top
L2  52.54,18.28 270 top
LOGO1  57.67,18.34 0 top
M1  53.5,30.1 180 top
M2  40.3,30.1 90 top
R1  45.5,8.29 180 top
R2  38.71,8.59 270 top
R3  40.76,8.52 270 top
R4  48.94,9.58 180 top
R5  63.84,9.02 232 top
S1  65.13,7.82 232 top
U1  11.45,26.2 0 top
U2  31.93,9.59 90 top
U3  4.48,16.31 0 top
U4  32.2,26.47 0 top
U5  32.19,19.2 0 top
U6  24.79,12.38 0 top
U7  28,20.6 0 top
U8  53.33,12.16 270 top
X1  60.99,7.77 0 top
X2  60.77,11.99 0 top
Y1  11.47,32.49 0 top

### Tracks (layer width: path | path; a pad name or v marks a point on that pad's centre or on a via)
+3V3  (via drill 0.2, 0.4, 0.5)
  Top 0.152: 24.2,9.6 24.2,9.3 24.21,9.29 C17.1 | 24.2,9.6 U6.P$8 | C19.1 27.45,10.32 U6.P$13 | C6.1 U1.P$45 16.4,24.7 | C7.1 U1.P$58 16.4,24.7 | v23.2,9.7 24.1,9.7 24.2,9.6 | U6.P$1 22.28,13.38 v21.8,12.9 | U2.P$6 34.4,9.55 34.4,8.7 34.9,8.2 v35,8.2 35.26,7.94 R2.2 | v5,24.1 5.27,24.37 C8.1 8.34,24.37 C9.1 8.36,23.64 8.8,23.2 U1.P$7 v16.51,23.2 16.4,23.31 16.4,24.7 | C5.1 13.32,14.82 13.9,15.4 U1.P$18 13.9,18.12 v14.21,18.43 | U7.P$13 30.15,19.6 30.46,19.91 | 30.46,19.91 C20.1 | U7.P$10 28.2,18.5 28.6,18.1 29.4,18.1 29.65,17.85 | 29.65,17.85 30,17.5 30,16.75 C22.1 | U7.P$8 27.4,18.03 | 27.4,18.03 27.4,16.85 C21.1 | 30.46,19.91 30.46,19.64 30.9,19.2 | 30.9,19.2 v31,19.1 | 30.9,19.2 30.9,19.1 29.65,17.85 | v26.6,18 27.37,18 27.4,18.03
  Top 0.203: U8.1 55.53,15.8 55.13,16.2 54.8,16.2 54.43,16.57 C25.1 54.16,16.79 53.6,17.34 v53.6,17.85 | U8.12 51.13,15.27 | C23.1 50.75,15.68 51.13,15.3 U8.12 | U8.12 50.9,14.93 v50.55,14.93 | J6.1 50.26,20.55 v50.38,20.67
  Top 0.205: U5.P$7 33.84,21.08 v34.05,21.29 | R1.1 46.67,8.29 46.91,8.53 v46.91,9.23
  Top 0.254: U4.P$7 33.85,26.89 33.73,26.77 33.73,26.24 33.85,26.12 U4.P$3 v33.85,24.19
  Top 0.305: U3.P$5 3.41,16.31 C1.1 3.38,14.78 v3.2,14.6 | J1.P$1 13.05,2.85 v12.9,3 | v27.9,11.2 27.9,10.66 C19.1
  Bottom 0.152: v31,19.1 31,18.14 | 31,18.14 31.61,17.53 31.71,17.53 32.31,16.93 32.31,16.73 32.61,16.43 34.53,16.43 35.7,17.6 | v16.51,23.2 16.51,21.23 15.61,20.33 14.41,20.33 13.91,19.83 13.91,18.73 v14.21,18.43 | v26.6,18 30.86,18 31,18.14
  Bottom 0.203: 53.45,19.38 51.67,19.38 v50.38,20.67 | 53.45,19.38 52.82,18.74 52.82,18.44 50.55,16.18 v50.55,14.93 50.55,11.93 49.74,11.12 48.7,11.12 47.35,9.77 | 53.45,19.38 53.75,19.38 54.09,19.05 54.09,18.34 v53.6,17.85
  Bottom 0.205: v33.85,24.19 33.85,21.49 v34.05,21.29 | 47.35,9.77 47.35,9.67 v46.91,9.23
  Bottom 0.305: 12.8,3.1 3.2,12.7 v3.2,14.6 3.2,23.2 4.1,24.1 v5,24.1 6.1,24.1 13.8,31.8 29,31.8 32.7,28.1 32.7,25.34 33.77,24.27 | 12.8,3.1 v12.9,3 | 12.8,3.1 21.9,3.1 23.2,4.4 23.2,9.5 | 23.2,9.5 v23.2,9.7 23.2,10.1 21.8,11.5 v21.8,12.9 | 23.2,9.5 23.6,9.5 24.4,8.7 25.2,8.7 26.4,9.9 26.6,9.9 v27.9,11.2 30.3,8.8 | 30.3,8.8 30.4,8.7 34.5,8.7 v35,8.2 | 33.77,24.27 v33.85,24.19 | 33.77,24.27 34.83,24.27 35.7,23.4 35.7,17.6 | 30.3,8.8 30.3,6.14 31.01,5.43 41.61,5.43 42.11,5.93 42.11,8.33 42.91,9.13 46.81,9.13 v46.91,9.23
A0
  Top 0.203: U8.45 56.84,13.16 56.9,13.23 58.53,13.23 59.52,12.24 C36.1 60.09,12.11 X2.A
A1
  Top 0.203: U8.46 56.71,13.56 56.73,13.58 58.68,13.58 59.52,12.75 60.97,12.75 61.32,12.4 X2.B 61.45,11.98 C37.1
AVDD  (via drill 0.2)
  Top 0.203: U8.35 55.13,8.68 55.23,8.61 55.43,8.61 55.53,8.71 U8.36 56.09,9.16 v56.32,9.39 56.38,9.34 C24.1 | L1.1 52.59,20.65 52.99,20.24 52.99,19.78 53.4,19.38 C26.1 53.7,18.79 v53.53,18.61
  Bottom 0.203: v53.53,18.61 51.27,16.35 51.27,14.32 50.96,14.02 50.96,10.61 51.62,9.95 55.76,9.95 v56.32,9.39
BLE_CS  (via drill 0.2)
  Top 0.152: U8.18 49.08,12.36 47.11,14.33 47.11,14.83 46.91,15.03 v45.81,15.03 | U1.P$31 20.4,17.62 20.71,17.93 21.51,17.93 v22.41,17.03
  Bottom 0.152: v22.41,17.03 22.41,15.93 23.01,15.33 28.71,15.33 29.01,15.63 29.91,15.63 30.61,14.93 30.61,14.23 30.91,13.93 30.91,13.53 31.41,13.03 44.01,13.03 45.01,14.03 45.01,14.83 45.21,15.03 v45.81,15.03
BLE_MISO  (via drill 0.2)
  Top 0.152: U8.16 49.48,13.16 47.91,14.73 47.91,16.43 47.71,16.63 v45.81,16.63 | U1.P$36 24.68,20.2 v24.71,20.23
  Bottom 0.152: v24.71,20.23 24.81,20.23 25.31,19.73 25.31,19.03 25.11,18.83 25.11,16.23 25.21,16.13 28.31,16.13 28.61,16.43 30.31,16.43 31.41,15.33 31.41,14.63 31.71,14.33 31.71,13.93 31.81,13.83 43.51,13.83 44.21,14.53 44.21,16.03 44.81,16.63 v45.81,16.63
BLE_MOSI  (via drill 0.2)
  Top 0.152: U8.17 49.28,12.76 47.51,14.53 47.51,15.63 47.31,15.83 v45.81,15.83 | U1.P$35 24.34,19.7 v24.71,19.33
  Bottom 0.152: v24.71,19.33 24.71,15.93 24.91,15.73 28.51,15.73 28.81,16.03 30.11,16.03 31.01,15.13 31.01,14.43 31.31,14.13 31.31,13.73 31.61,13.43 43.71,13.43 44.61,14.33 44.61,15.53 44.91,15.83 v45.81,15.83
BLE_SCLK  (via drill 0.2)
  Top 0.152: U8.15 49.68,13.56 48.31,14.93 48.31,16.93 47.81,17.43 v45.81,17.43 | U1.P$44 24.04,24.2 24.41,23.83 25.41,23.83 26.01,23.23 26.01,22.63 25.41,22.03 25.41,21.83 v24.71,21.13
  Bottom 0.152: v24.71,21.13 25.51,20.33 25.51,20.13 25.71,19.93 25.71,18.83 25.51,18.63 25.51,16.63 25.61,16.53 28.11,16.53 28.41,16.83 30.51,16.83 31.81,15.53 31.81,14.83 32.11,14.53 32.11,14.33 32.21,14.23 43.21,14.23 43.81,14.83 43.81,16.43 44.81,17.43 v45.81,17.43
D+
  Top 0.152: U2.P$4 33.4,9.59 33.4,8.8 33.2,8.6 33.2,8 33.1,7.9 arc127 33.2,7.6 arc-164 33.2,7.3 arc74 33.1,7.2 arc22 J3.P$3
D-  (via drill 0.4)
  Top 0.152: U2.P$5 v33.94,7.88 | v32.34,7.88 J3.P$2
  Bottom 0.152: v32.34,7.88 v33.94,7.88
DCC
  Top 0.203: U8.2 55.13,15.69 54.97,15.85 54.29,15.85 53.75,16.38 53.75,16.63 52.75,17.63 L2.2
ERM_EN  (via drill 0.2, 0.4)
  Top 0.152: U5.P$1 v31.9,18.2 | U1.P$42 24.6,23.2 v24.9,22.9
  Bottom 0.152: v24.9,22.9 31.5,22.9 31.9,22.5 v31.9,18.2
ERM_PWM  (via drill 0.2, 0.4)
  Top 0.152: U1.P$47 24.5,25.7 24.7,25.9 29.5,25.9 31.6,23.8 v32.7,23.8 | U5.P$2 33.34,17.46 v33.11,17.23
  Bottom 0.152: v32.7,23.8 32.7,17.6 32.74,17.6 v33.11,17.23
GND  (via drill 0.2, 0.4)
  Top 0.152: U2.GND_PAD 32.93,11.49 U2.P$3 32.93,8.86 32.81,8.73 | U1.P$46 24.48,25.2 | C6.2 26.39,25.45 26.31,25.53 24.81,25.53 | v48.45,23.67 48.54,21.67 J6.5 | v53.83,11.65 53.83,11.66 U8.GND
  Top 0.203: C25.2 54.49,17.65 55,17.12 55.33,16.79 55.38,16.79 55.38,16.51 55.94,15.95 | C23.2 49.56,15.64 49.94,15.26 49.94,14.75 U8.13 50.99,14.36 v51.8,13.69 | 54.97,20.68 54.97,19.7 C26.2 | 54.73,7.6 U8.34 54.73,10.39 v54.85,10.64 54.33,9.99 U8.33 | v53.83,13.69 v54.85,13.69 | C36.2 58.58,12.11 v57.62,12.07 | C37.2 63.18,13.21 63.78,12.61
  Top 0.305: B1.GND 54.73,7.6
  other vias: 18.3,12.8 11.4,8.5 25.5,1.8 33.9,1.9 20.3,23.2 23.81,17.03 55.74,19.59 52.82,11.65 51.8,11.65 54.85,11.65 53.83,10.64 52.82,10.64 51.8,10.64 51.8,12.67 52.82,12.67 54.85,12.67 53.83,12.67 52.82,13.69 49.12,6.86 55.97,6.97 58.43,8.48 50.12,8.8 44.26,6.21 49.67,14.93 61.93,9.22 67.29,10.16 50.83,6.88 56.9,6.52 47.22,6.83 23.21,27.53
  pour Top: -2.34,37.84 75.4,38.14 74.9,-2.54 -2.54,-2.54
  pour Bottom: -2.34,37.81 75.43,38.11 74.93,-2.54 -2.54,-2.54
  pour Top: 70.24,6.07 54.47,6.07 54.47,9.45 52.87,9.45 52.87,6.07 42.3,6.07 42.3,28.8 70.24,28.8
LRA_EN
  Top 0.152: U1.P$52 19.4,29.1 19.7,29.4 22.9,29.4 25.6,26.7 30,26.7 31.2,25.5 32.82,25.5 U4.P$1
LRA_PWM
  Top 0.152: U1.P$48 24.4,26.2 24.5,26.3 29.7,26.3 31.4,24.6 33.1,24.6 33.35,24.85 U4.P$2
MPU_CS  (via drill 0.4)
  Top 0.152: U6.P$22 24.59,14.71 24.2,15.1 23.3,15.1 22.9,14.7 20.9,14.7 20.6,15 19.5,15 18.9,15.6 U1.P$28 18.9,18.2 19.2,18.5 v20,18.3 | v29.7,24.3 29.7,23.9 29.4,23.6 28.5,23.6 27.8,22.9 U7.P$22
  Bottom 0.152: v20,18.3 20,18.9 19.6,19.3 19.6,20.4 20,20.8 21.9,20.8 22.3,21.2 22.3,23.6 24.3,25.6 29.3,25.6 29.7,25.2 v29.7,24.3
MPU_MISO  (via drill 0.4)
  Top 0.152: U6.P$9 24.59,9.85 v24.96,9.48 | U1.P$27 v18.4,14.8 | U7.P$9 27.8,18.14 28.61,17.33 28.61,15.69 v29.5,14.8
  Bottom 0.152: v24.96,9.48 24.62,9.48 22.5,11.6 22.5,12.5 22.8,12.8 22.8,14.8 | 22.8,14.8 22.1,15.5 19.3,15.5 18.6,14.8 v18.4,14.8 | 22.8,14.8 v29.5,14.8
MPU_MOSI  (via drill 0.4)
  Top 0.152: U6.P$24 21.18,13.98 20.6,13.4 19.6,13.4 19.4,13.2 19.4,11.5 18.9,11 15.8,11 15.5,11.3 15.5,15.2 15.9,15.6 U1.P$22 15.9,19.7 16.3,20.1 17.7,20.1 18.1,19.7 18.9,19.7 19.6,19 20.8,19 v21.4,19.6 | v27.7,24.3 27,23.6 U7.P$24
  Bottom 0.152: v21.4,19.6 21.6,19.8 22.2,19.8 23.2,20.8 23.2,23.2 24.3,24.3 v27.7,24.3
MPU_SCL  (via drill 0.4)
  Top 0.152: v20.2,12.5 20.2,11.8 19,10.6 15.5,10.6 15.1,11 15.1,15.4 15.4,15.7 U1.P$21 15.4,19.9 16,20.5 17.8,20.5 18.2,20.1 19,20.1 19.4,19.7 v20.3,19.7 | U6.P$23 24.19,14.51 24,14.7 23.5,14.7 23.1,14.3 v20.2,14.3 | U7.P$23 27.4,23.5 27.5,23.6 28,23.6 v28.7,24.3
  Bottom 0.152: v20.2,12.5 v20.2,14.3 | v20.3,19.7 20.3,19.8 20.8,20.3 22.1,20.3 22.7,20.9 22.7,23.4 24.5,25.2 27.8,25.2 v28.7,24.3
N$1
  Top 0.152: U2.P$9 35.84,11 37.9,11 38.71,10.19 R2.1
N$2
  Top 0.254: U4.P$6 66.87,27.47 M1.P$1
N$3
  Top 0.254: U4.P$9 32.85,28.45 33.4,29 62.7,29 65.8,32.1 M1.P$2
N$4
  Top 0.152: U2.P$11 37.94,11.99 R3.1
N$5
  Top 0.152: R3.2 D1.AN
N$6
  Top 0.152: U1.P$64 12.61,28.94 C4.1
N$7
  Top 0.406: J2.VCC 4.48,9.04 4.48,12 | 4.48,12 U3.P$1 | U3.P$3 6.38,12.78 5.6,12 4.48,12
N$8
  Top 0.254: U5.P$9 32.84,22.34 33.2,22.7 35.9,22.7 36.9,21.7 40.5,21.7 42.3,19.9 M2.P$2
N$9
  Top 0.152: C18.1 26.03,9.37 24.99,10.41 U6.P$10
N$10
  Top 0.254: U5.P$6 36.8,20.2 38.3,18.7 M2.P$1
N$11
  Top 0.203: B1.ANT1 53.53,8.25 U8.31
N$12
  Top 0.203: B1.ANT2 53.93,8.25 U8.32
N$13  (1 unrouted)
  Top 0.203: 53.73,6.79 53.73,6.32
  Top 0.254: B1.SE 53.73,6.79
  Top 0.762: 53.73,6.32 C35.1
  Top 1.27: 53.73,6.32 53.73,4.17
N$14
  Top 0.203: L1.2 52.38,19.09 L2.1
N$15  (via drill 0.2)
  Top 0.203: U8.19 49.72,11.96 v49.49,11.73
  Top 0.205: D2.C 47.02,11.28 v47.04,11.3
  Bottom 0.205: v47.04,11.3 47.68,11.3 47.97,11.59 48.77,11.59 48.91,11.73 v49.49,11.73
N$16
  Top 0.203: U8.37 56.72,9.96 57.84,8.84 57.84,8.1 58.63,7.31 C27.1 60.66,7.31 X1.1
N$17
  Top 0.203: U8.38 56.9,10.36 58.17,9.09 60.92,9.09 X1.3 62.55,8.32 C28.1
N$18
  Top 0.203: C29.1 58.2,9.62 57.06,10.76 U8.39
N$19
  Top 0.203: U8.29 52.73,8.72 52.21,8.2 C30.1
N$20
  Top 0.203: R5.2 63.57,7 S1.2
N$23
  Top 0.205: R1.2 D2.A
NC
  cutout Bottom: 44.91,6.53 44.91,-0.25 67.71,-0.25 67.71,6.53 57.41,6.53 57.41,5.83 55.91,5.83 55.91,6.43 51.41,6.43 51.41,6.33 50.31,6.33 47.21,5.93 47.14,5.98 46.84,5.98 46.91,6.53
NRST  (via drill 0.4)
  Top 0.152: J1.P$10 v19.1,8.9 | U1.P$39 v21.4,21.7
  Bottom 0.152: v19.1,8.9 18.4,9.6 16.4,9.6 16.2,9.8 16.2,10.4 17.2,11.4 17.2,15.5 19.1,17.4 19.1,20.6 20.2,21.7 v21.4,21.7
SWCLK  (via drill 0.4)
  Top 0.152: U1.P$53 18.9,27.3 19.3,26.9 19.3,26.3 v19.5,26.1 | J1.P$4 v15.3,8.9
  Bottom 0.152: v19.5,26.1 19.5,26 18.9,25.4 18.9,21.6 18.3,21 18.3,17.55 16.54,15.79 16.53,12.29 15.3,10.7 v15.3,8.9
SWDCLK
  Top 0.152: 44.61,15.53 44.61,16.81 44.59,16.84
  Top 0.203: 44.59,16.84 44.59,18.69 45.42,19.53 48.35,19.53 J6.4 | U8.24 49.75,9.96 R4.1 49.38,9.62
  Top 0.205: R4.1 49.38,8.99 49.11,8.73 48.21,8.73 46.91,7.43 44.11,7.43 43.81,7.73 43.81,12.73 44.61,13.53 44.61,15.53
SWDIO  (via drill 0.4)
  Top 0.152: U1.P$51 19.9,26.8 20.1,26.6 20.1,26.5 20.2,26.4 20.2,25.6 20,25.4 19.1,25.4 18.9,25.6 18.6,25.6 18.5,25.7 v18.5,25.9 | J1.P$2 14.1,6.82 v14.1,8.9
  Bottom 0.152: v14.1,8.9 14.1,10 16.2,12.4 16.2,16 17.9,17.7 17.9,21.2 18.5,21.8 v18.5,25.9
SWDIO/!RESET  (via drill 0.2)
  Top 0.203: 49.91,10.36 U8.23 49.49,10.36 v49.35,10.5 48.93,10.92 48.43,11.44 | v49.36,19.73 49.36,18.92 J6.2 | v63.43,9.83 63.64,9.83 R5.1
  Top 0.205: 48.43,11.44 48.43,11.54 v47.55,12.42
  Bottom 0.203: 48.45,18.82 v49.36,19.73 | v63.43,9.83 57.74,9.83 56.65,8.73 56.09,8.73 55.23,9.6 50.25,9.6 v49.35,10.5
  Bottom 0.205: 48.45,18.82 48.45,13.32 v47.55,12.42
SWO/TDO  (via drill 0.4)
  Top 0.152: U1.P$49 v20.9,26.7 | J1.P$6 16.6,6.78 v16.6,8.9
  Bottom 0.152: v20.9,26.7 20.9,26.3 20,25.4 19.7,25.4 19.3,25 19.3,21.4 18.7,20.8 18.7,17.49 16.88,15.67 16.84,12.1 15.8,10.5 15.8,9.7 v16.6,8.9
UART_SAM4S_RX_BLE_TX  (via drill 0.2, 0.4)
  Top 0.152: U1.P$11 12.68,21.2 v13.01,21.53 | v24.41,4.23 23.71,4.23 23.21,4.73 v22.01,4.73 | U8.48 56.33,14.65 57.11,15.43 v58.31,15.43 | v43.51,5.63 43.51,6.63 42.81,7.33 v42.81,10.73
  Bottom 0.152: v13.01,21.53 13.01,21.13 12.31,20.43 12.31,19.03 12.61,18.73 12.61,5.23 13.91,3.93 21.21,3.93 v22.01,4.73 | v24.41,4.23 25.01,4.23 25.81,5.03 29.31,5.03 30.21,4.13 42.01,4.13 v43.51,5.63 | v42.81,10.73 42.81,10.93 43.61,11.73 44.81,11.73 47.11,14.03 47.11,18.93 49.91,21.73 57.11,21.73 58.31,20.53 v58.31,15.43
UART_SAM4S_TX_BLE_RX  (via drill 0.2, 0.4)
  Top 0.152: U1.P$14 12.98,19.7 v13.11,19.83 | v24.41,5.43 23.21,5.43 22.81,5.83 v21.61,5.83 | U8.47 56.94,13.96 57.41,14.43 v58.31,14.43 | v42.81,6.33 42.81,6.63 42.21,7.23 v42.21,11.23
  Bottom 0.152: v13.11,19.83 13.11,5.43 14.11,4.43 20.21,4.43 v21.61,5.83 | v24.41,5.43 29.51,5.43 30.41,4.53 41.81,4.53 42.81,5.53 v42.81,6.33 | v42.21,11.23 42.21,11.63 42.71,12.13 44.61,12.13 46.71,14.23 46.71,19.13 49.71,22.13 57.71,22.13 59.51,20.33 59.51,15.63 v58.31,14.43
URXD0  (via drill 0.4)
  Top 0.152: U1.P$30 19.9,15.8 20,15.7 20.9,15.7 21.2,15.4 22.5,15.4 22.9,15.8 26.9,15.8 29,13.7 v29.8,13.7 | U2.P$26 30.5,11.5 30.2,11.2 v29.8,11.2
  Bottom 0.152: v29.8,13.7 v29.8,11.2
UTXD0
  Top 0.152: U1.P$29 19.4,15.7 19.78,15.32 20.76,15.32 21.06,15.02 22.74,15.02 23.15,15.43 24.41,15.43 24.44,15.4 26.8,15.4 29.3,12.9 29.3,12.6 29.91,11.99 U2.P$25
VBUS  (via drill 0.4)
  Top 0.152: v31.1,7.9 29.57,7.9 C15.1 29.1,7.33 29.1,6.4 28.7,6 27.2,6 26.82,5.62 C16.1
  Top 0.205: U2.P$8 35.83,9.7 | 35.83,9.7 35.83,8.94 v35.8,8.9 | U2.P$7 35.72,9.59 35.83,9.7
  Top 0.305: J3.P$1 31.54,7.46 v31.1,7.9
  Bottom 0.305: v31.1,7.9 31.1,7 35.8,7 v35.8,8.9
VDD_PA
  Top 0.203: U8.30 53.13,8.52 52.67,8.06 C31.1 B1.VCC
VDDOUT  (via drill 0.4)
  Top 0.152: C14.1 18.94,30.24 18.4,29.7 U1.P$54 18.4,26.6 18.2,26.6 17.6,26 v17.6,25.5 v17.61,25.49 | C11.1 6.13,22.07 C10.1 8.47,22.7 U1.P$8 15.64,22.7 16.01,22.33 17.51,22.33 17.61,22.43 | C12.1 9.39,18.81 9.4,18.8 9.4,19.9 10.2,20.7 U1.P$12 14.34,20.7 14.71,20.33 14.71,20.13 | C13.1 16.76,15.56 16.9,15.7 U1.P$24 v16.9,19.4 | 14.71,20.13 v14.71,19.51 v14.7,19.5 | 14.71,20.13 15.01,20.13 15.81,20.93 17.31,20.93 17.61,21.23 17.61,22.43 | 17.61,22.43 v17.61,23.77 v17.6,23.78
  Bottom 0.152: v16.9,19.4 14.8,19.4 v14.7,19.5 | v17.6,23.78 v17.6,25.5
XIN
  Top 0.152: U1.P$62 14.4,29.5 11.96,29.5 Y1.P$1 C2.1
XOUT
  Top 0.152: U1.P$61 14.9,31.8 14.21,32.49 Y1.P$3 14.61,33.33 C3.1

### Text on the board
tPlace: A | Squall
bPlace: 2014/10/08 | Brad / Campbell